# EAGLE design LED_KnuckleBuster (EAGLE 7.6.0)
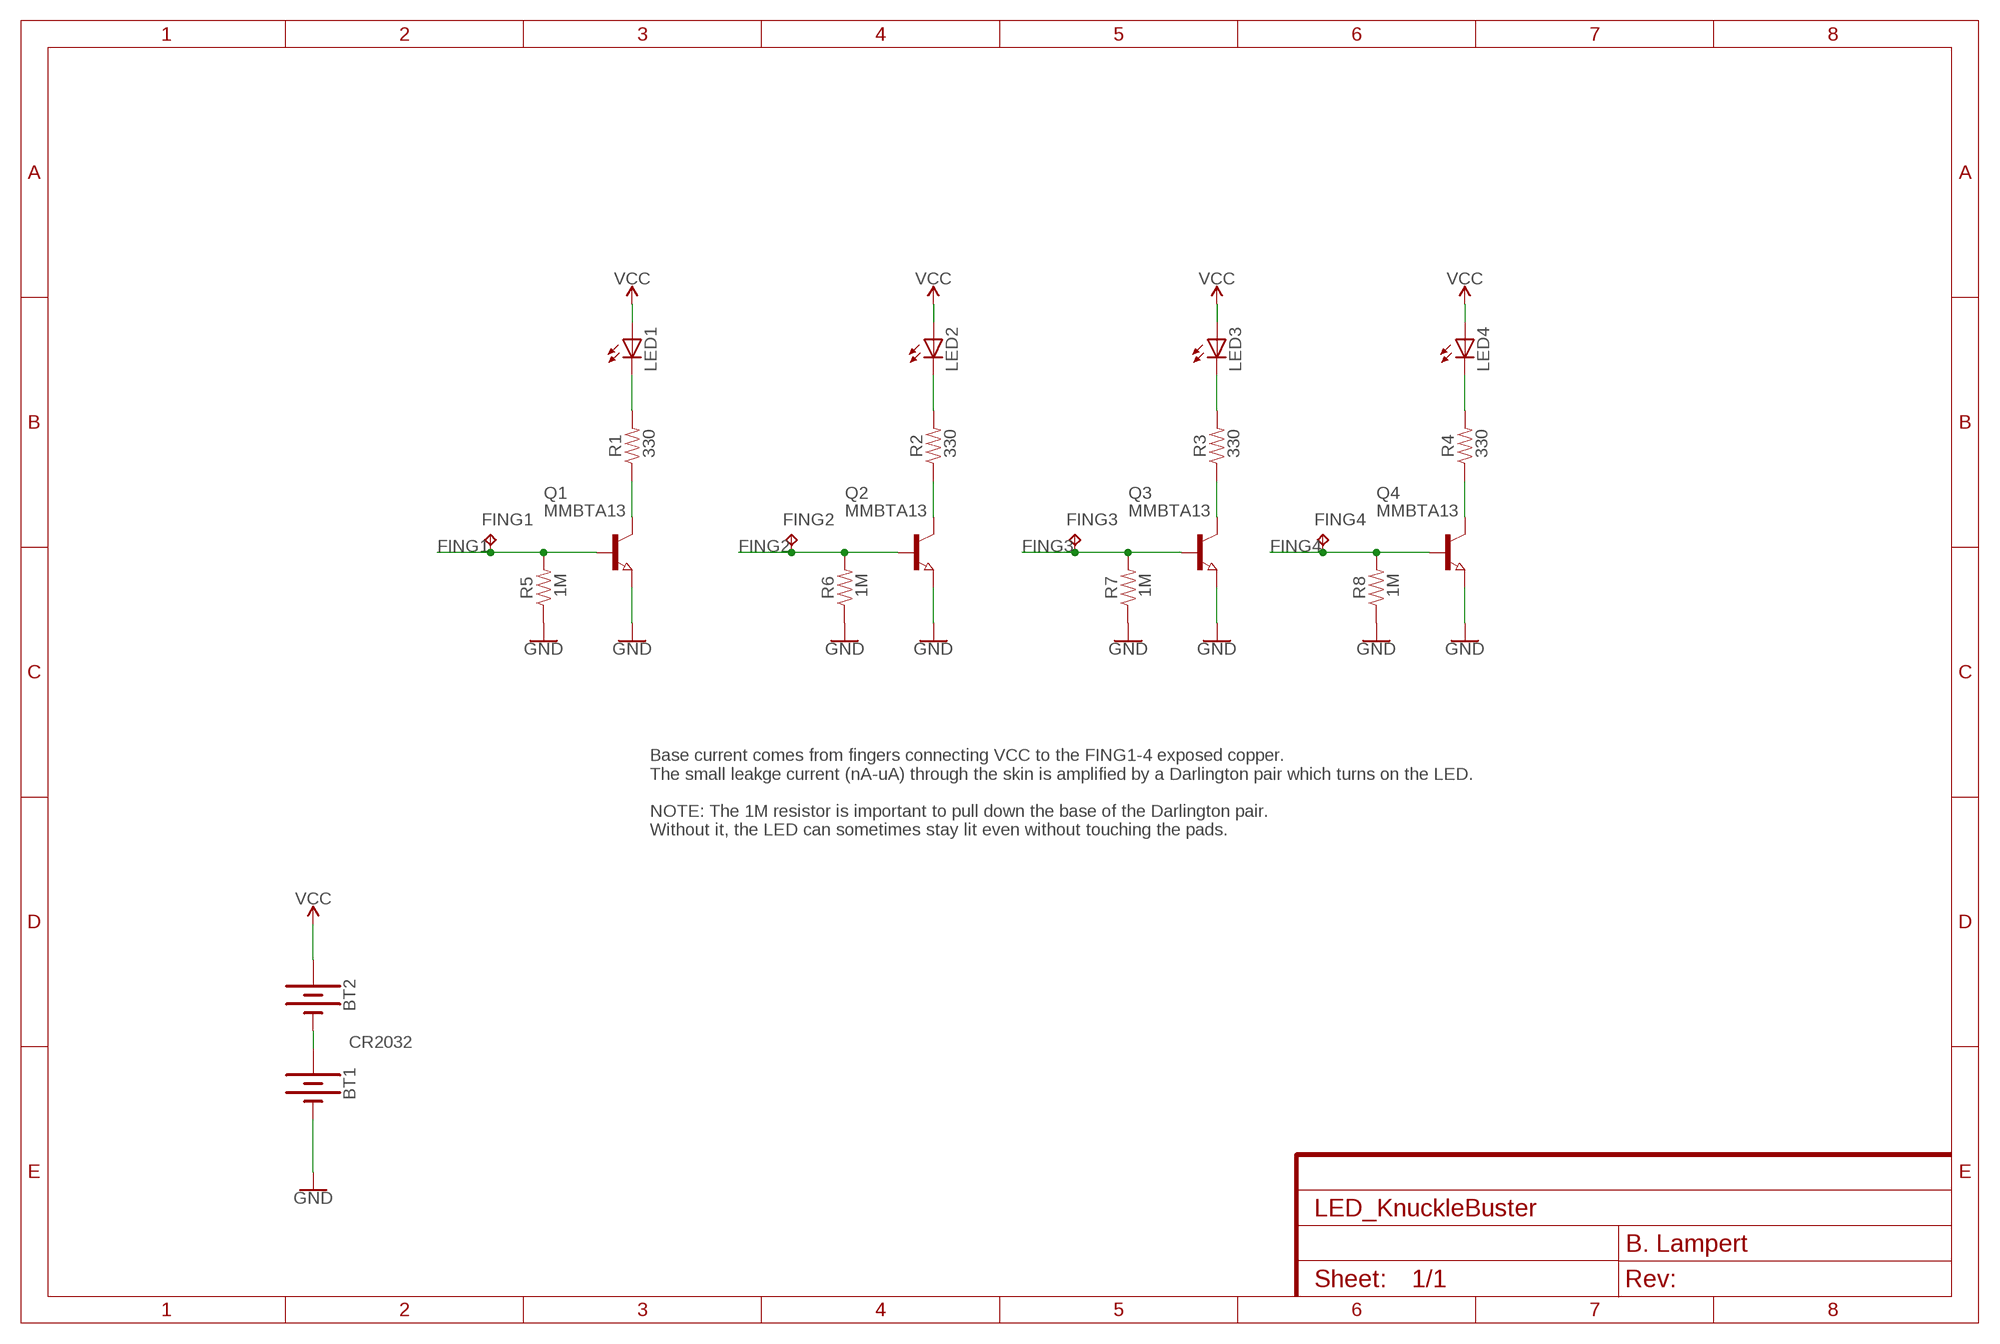
[diagram p0: schematic, sheet 1]

## Parts
BT1  BATTERY-20MM_SMD_4LEGS  [BATTCON_20MM_4LEGS]
BT2  BATTERY-20MM_SMD_4LEGS  [BATTCON_20MM_4LEGS]
FING1  TPB2,54  [B2,54]
FING2  TPB2,54  [B2,54]
FING3  TPB2,54  [B2,54]
FING4  TPB2,54  [B2,54]
LED1  LEDCHIPLED_0805  [CHIPLED_0805]
LED2  LEDCHIPLED_0805  [CHIPLED_0805]
LED3  LEDCHIPLED_0805  [CHIPLED_0805]
LED4  LEDCHIPLED_0805  [CHIPLED_0805]
Q1  MMBTA13  NPN-TRANSISTOR_SOT23  [SOT23]
Q2  MMBTA13  NPN-TRANSISTOR_SOT23  [SOT23]
Q3  MMBTA13  NPN-TRANSISTOR_SOT23  [SOT23]
Q4  MMBTA13  NPN-TRANSISTOR_SOT23  [SOT23]
R1  330  RESISTOR0603  [0603]
R2  330  RESISTOR0603  [0603]
R3  330  RESISTOR0603  [0603]
R4  330  RESISTOR0603  [0603]
R5  1M  RESISTOR0603  [0603]
R6  1M  RESISTOR0603  [0603]
R7  1M  RESISTOR0603  [0603]
R8  1M  RESISTOR0603  [0603]

## Nets
FING1: FING1.TP Q1.1(B) R5.2
FING2: FING2.TP Q2.1(B) R6.2
FING3: FING3.TP Q3.1(B) R7.2
FING4: FING4.TP Q4.1(B) R8.2
GND: BT1.NEGATIVE(-) Q1.2(E) Q2.2(E) Q3.2(E) Q4.2(E) R5.1 R6.1 R7.1 R8.1
N$1: Q1.3(C) R1.1
N$2: LED1.C R1.2
N$3: Q2.3(C) R2.1
N$4: LED2.C R2.2
N$5: Q3.3(C) R3.1
N$6: LED3.C R3.2
N$7: Q4.3(C) R4.1
N$8: LED4.C R4.2
N$9: BT1.POSITIVE@1(+) BT1.POSITIVE@2(+) BT1.POSITIVE@3(+) BT1.POSITIVE@4(+) BT2.NEGATIVE(-)
VCC: BT2.POSITIVE@1(+) BT2.POSITIVE@2(+) BT2.POSITIVE@3(+) BT2.POSITIVE@4(+) LED1.A LED2.A LED3.A LED4.A

## Notes on the sheet
- Base current comes from fingers connecting VCC to the FING1-4 exposed copper.
  The small leakge current (nA-uA) through the skin is amplified by a Darlington pair which turns on the LED.
  
  NOTE: The 1M resistor is important to pull down the base of the Darlington pair.
  Without it, the LED can sometimes stay lit even without touching the pads.
- CR2032

## Library data of the parts
BT1 BT2 = SparkFun-Batteries:BATTERY: Battery - Single Cell A variety of battery chemistries, sizes, and footprints. Device List: 20MM_PTH - Coin Cell Battery Holder - 20mm (PTH) <https://www.sparkfun.com/products/783> 6.8MM_PTH - Coin Cell Battery Holder - 6.8MM(SMD) <https://www.digikey.com/product-detail/en/seiko-instruments/MS621FE-FL11E/728-1057-ND/1889208?WT.srch=1&gclid=CNOQ5a6LzdQCFZS2wAodXCkE0g> 12MM_SMD - Coin Cell Battery Holder - 12mm (SMD) <https://www.sparkfun.com/products/10592> 12MM_PTH - Coin Cell Battery Holder - 12mm (PTH) <https://www.sparkfun.com/products/7948> 20MM_SMD - 20mm Coin Cell Battery Holder (SMD) (2 legs) Used on the Big Time Watch Kit <https://www.sparkfun.com/products/11734> 20MM_SMD_4LEGS - Coin Cell Battery Holder - 20mm (SMD) <https://www.sparkfun.com/products/11892> 20MM_SMD_4LEGS_OVERPASTE - Coin Cell Battery Holder - 20mm (SMD) <https://www.sparkfun.com/products/11892> (Over-paste on the legs) 24.5MM_PTH - Coin Cell Battery Holder - 24.5mm (PTH) <https://www.sparkfun.com/products/8863> 9V - 9V Battery Holder - PC Mount Used on the SparkFun SparkPunk Sound Kit <https://www.sparkfun.com/products/11177> and SparkFun SparkPunk Sequencer Kit <https://www.sparkfun.com/products/12707> 18650 - Battery Holder - 18650 (PTH) <https://www.sparkfun.com/products/13113> AA - Battery Holder - 1xAA (PTH) <https://www.sparkfun.com/products/7949> AAA - Battery Holder - 1xAAA (PTH) <https://www.sparkfun.com/products/12718> AA_KIT - Battery Holder - 1xAA (PTH) <https://www.sparkfun.com/products/7949> Special kit package - pads only have exposed copper on one side of the board. AAA_KIT - Battery Holder - 1xAAA (PTH) <https://www.sparkfun.com/products/12718> Special kit package - pads only have exposed copper on one side of the board.; PROD_ID: BATT-10373; SF_SKU: PRT-11892
FING1-FING4 = testpad:TP: Test pad
LED1-LED4 = led:LED: LED OSRAM: - CHIPLED LG R971, LG N971, LY N971, LG Q971, LY Q971, LO R971, LY R971 LH N974, LH R974 LS Q976, LO Q976, LY Q976 LO Q996 - Hyper CHIPLED LW Q18S LB Q993, LB Q99A, LB R99A - SideLED LS A670, LO A670, LY A670, LG A670, LP A670 LB A673, LV A673, LT A673, LW A673 LH A674 LY A675 LS A676, LA A676, LO A676, LY A676, LW A676 LS A679, LY A679, LG A679 - Hyper Micro SIDELED® LS Y876, LA Y876, LO Y876, LY Y876 LT Y87S - SmartLED LW L88C, LW L88S LB L89C, LB L89S, LG L890 LS L89K, LO L89K, LY L89K LS L896, LA L896, LO L896, LY L896 - TOPLED LS T670, LO T670, LY T670, LG T670, LP T670 LSG T670, LSP T670, LSY T670, LOP T670, LYG T670 LG T671, LOG T671, LSG T671 LB T673, LV T673, LT T673, LW T673 LH T674 LS T676, LA T676, LO T676, LY T676, LB T676, LH T676, LSB T676, LW T676 LB T67C, LV T67C, LT T67C, LS T67K, LO T67K, LY T67K, LW E67C LS E67B, LA E67B, LO E67B, LY E67B, LB E67C, LV E67C, LT E67C LW T67C LS T679, LY T679, LG T679 LS T770, LO T770, LY T770, LG T770, LP T770 LB T773, LV T773, LT T773, LW T773 LH T774 LS E675, LA E675, LY E675, LS T675 LS T776, LA T776, LO T776, LY T776, LB T776 LHGB T686 LT T68C, LB T68C - Hyper Mini TOPLED® LB M676 - Mini TOPLED Santana® LG M470 LS M47K, LO M47K, LY M47K Source: http://www.osram.convergy.de LUXEON: - LUMILED® LXK2-PW12-R00, LXK2-PW12-S00, LXK2-PW14-U00, LXK2-PW14-V00 LXK2-PM12-R00, LXK2-PM12-S00, LXK2-PM14-U00 LXK2-PE12-Q00, LXK2-PE12-R00, LXK2-PE12-S00, LXK2-PE14-T00, LXK2-PE14-U00 LXK2-PB12-K00, LXK2-PB12-L00, LXK2-PB12-M00, LXK2-PB14-N00, LXK2-PB14-P00, LXK2-PB14-Q00 LXK2-PR12-L00, LXK2-PR12-M00, LXK2-PR14-Q00, LXK2-PR14-R00 LXK2-PD12-Q00, LXK2-PD12-R00, LXK2-PD12-S00 LXK2-PH12-R00, LXK2-PH12-S00 LXK2-PL12-P00, LXK2-PL12-Q00, LXK2-PL12-R00 Source: www.luxeon.com KINGBRIGHT: KA-3528ASYC Source: www.kingbright.com
Q1-Q4 = semicon-smd-ipc:NPN-TRANSISTOR_: NPN TRANSISTOR
R1-R8 = SparkFun-Resistors:RESISTOR: Generic Resistor Package

## Board
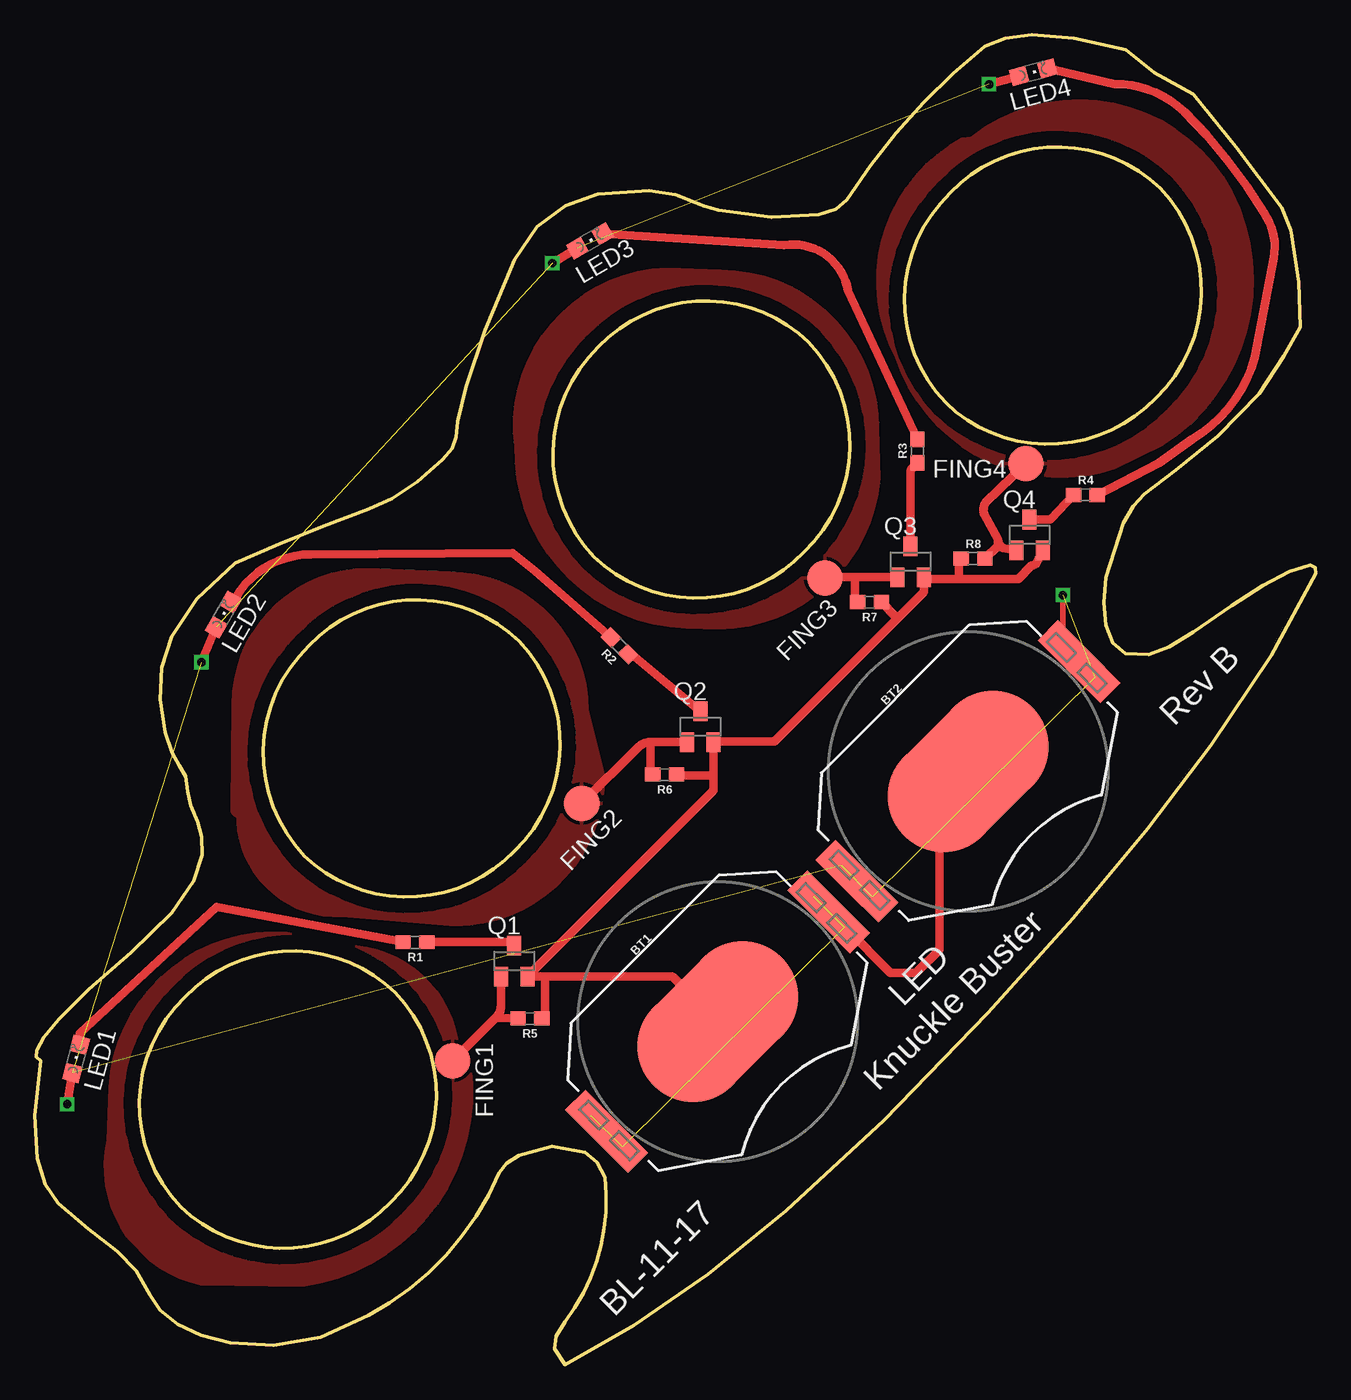
[diagram p1: board, top side]
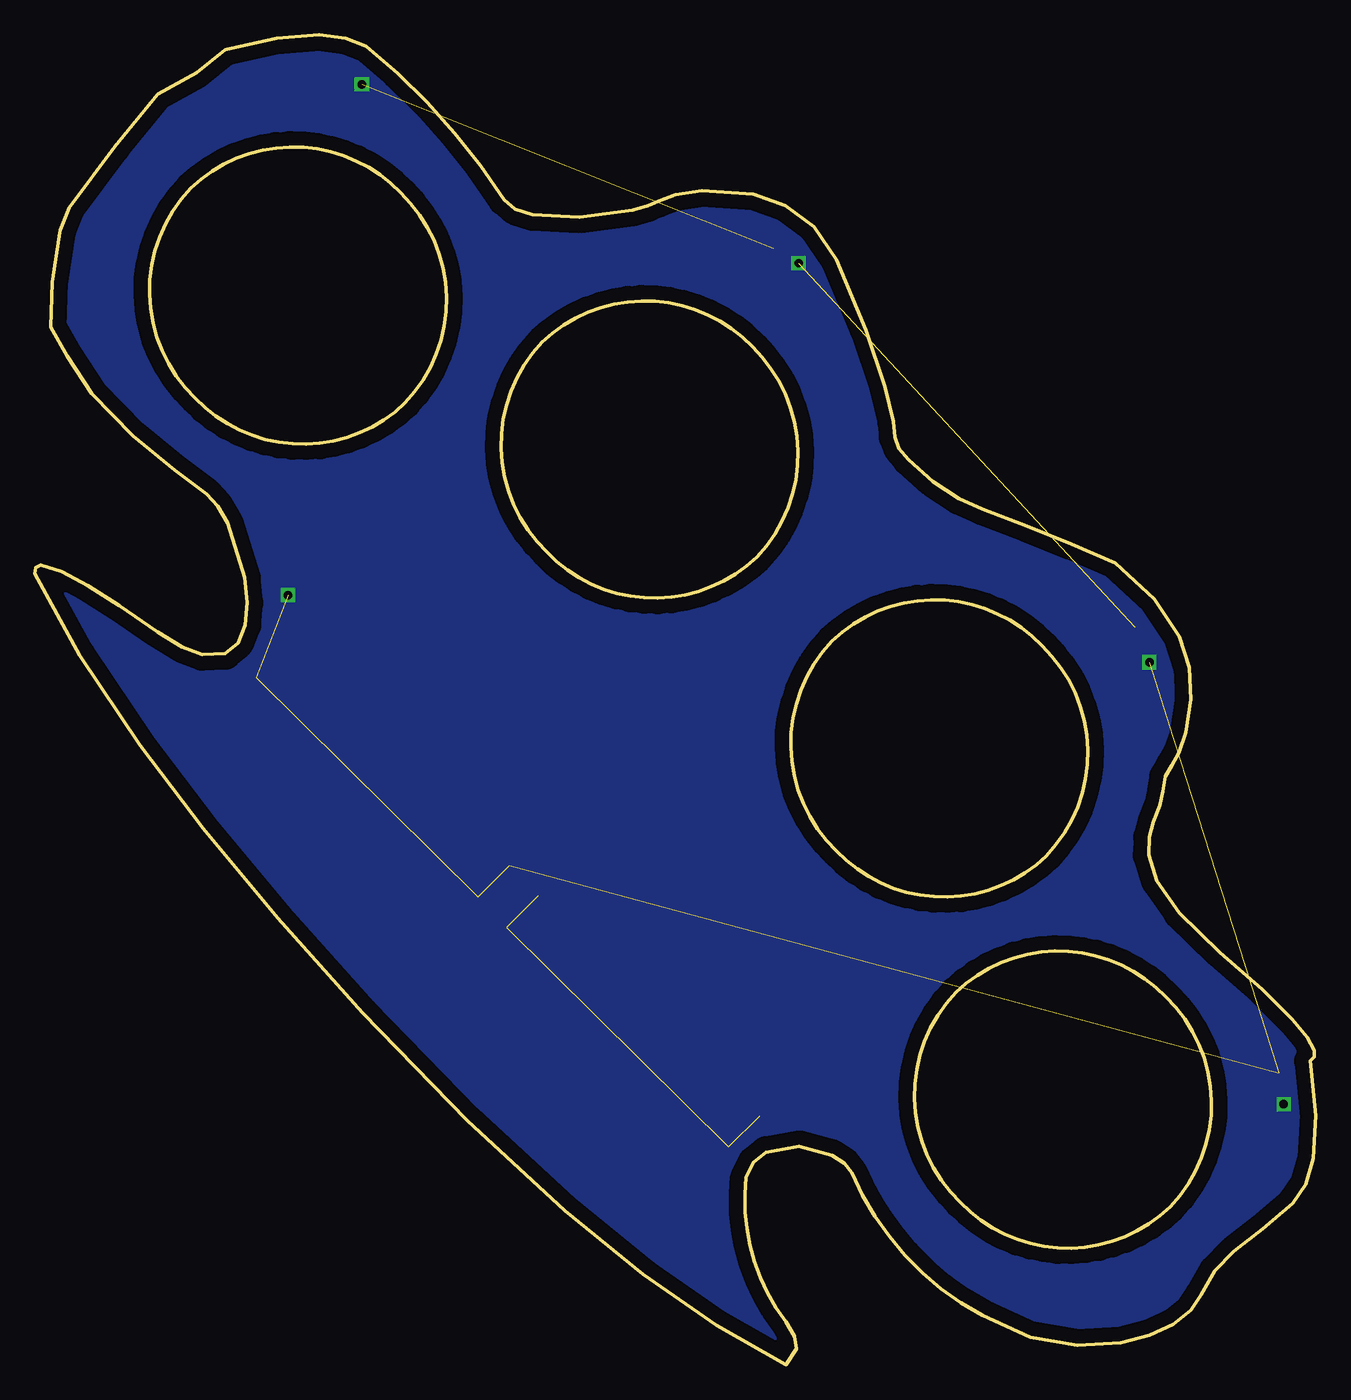
[diagram p2: board, bottom side, seen from below]

Size 91.69 x 95.17 mm. Coordinates in mm from the lower left corner, seen from the top.
Outline: 89.88,81.23 90.46,77.46 90.57,74.27 89.39,72.18 87.64,69.51 84.67,66.44 81.67,64.02 79.4,62.31 78.62,61.45 77.9,60.24 76.67,56.32 76.5,54.53 76.64,52.92 77.15,51.65 78.06,50.88 79.73,50.82 81.17,51.36 82.91,52.44 85.66,54.34 87.9,55.75 89.79,56.78 91.27,57.21 91.63,57.05 91.69,56.61 88.48,50.76 84.17,44.3 79.65,38.36 74.33,31.98 68.22,25.17 60.77,17.49 53.76,11.02 48.17,6.47 42.89,2.8 37.94,0 37.18,1.13 37.32,2.03 37.94,3.07 arc44 40.79,13.38 40.25,14.49 39.36,15.19 37,15.6 34.65,14.99 33.76,14.41 33.22,13.71 arc-38 23.89,3.51 20.45,1.96 17.07,1.37 13.96,1.55 11.92,2.09 10.23,2.89 8.97,3.88 8.25,4.98 7.25,6.71 5.88,8.1 3.82,9.71 1.66,11.56 0.74,12.92 0.18,14.77 0,17.84 0.42,21.72 0.11,22.01 0.12,22.5 0.63,23.44 1.69,24.72 3.84,26.84 6.89,29.51 9.79,32.32 11.38,34.61 11.97,36.47 11.94,37.75 11.64,38.84 11.16,40.01 10.95,41.03 10.8,42.09 10.33,42.88 9.82,43.77 9.33,45.24 8.97,47.61 9.08,49.89 9.8,52.1 11.58,54.8 14.35,57.37 arc-5 23.89,61.21 25.56,61.98 27.4,63.21 29.18,64.77 29.84,65.57 30.15,66.37 30.25,67.49 30.85,69.99 32.22,74.04 34.34,79.07 35.94,81.44 37.99,82.96 40.25,83.79 43.95,84.03 45.84,83.72 47.04,83.26
Outline: 89.23,82.8 85.96,87.17 82.9,90.92 80.11,92.47 78.09,94.13 74.38,94.94 71.35,95.17 69.46,94.94 67.99,94.35 arc19 58.12,83.37 57.33,82.7 56.07,82.29 52.7,82.13 48.93,82.63 47.8,82.94 47.04,83.26
Outline: 47.04,83.26 47.04,83.26
Outline: 19.29,36.42 arc90 34.32,36.75 arc90 34.64,51.78 arc90 19.62,51.45 arc90 19.29,36.42
Outline: 65.52,83.86 arc-90 80.55,84.19 arc-90 80.22,69.16 arc-90 65.19,68.83 arc-90 65.52,83.86
Outline: 89.87,81.19 89.23,82.82
Outline: 25.78,26.64 arc90 10.75,26.31 arc90 10.43,11.28 arc90 25.46,11.61 arc90 25.78,26.64
Outline: 55.38,73.17 arc90 40.35,72.84 arc90 40.02,57.81 arc90 55.05,58.14 arc90 55.38,73.17
Copper layers (1*16): Top 0.035mm / dielectric 1.5mm / Bottom 0.035mm
Design rules "default": minimum track width 10mil, minimum drill 24mil, track to track 8mil, track to pad 8mil, pad to pad 8mil, via to via 8mil, smd to smd 8mil, copper to edge 40mil, drill to drill 8mil, minimum pad ring 10mil, minimum via ring 8mil, stop-mask expansion 4mil, vias tented up to drill 0mil, thermal gap 10mil

### Footprints (pad centres in the part's own frame; a part is rotated, then mirrored left to right if it is on the bottom)
BATTCON_20MM_4LEGS = smd 13 x 8: NEGATIVE 0,0 | smd 2.032 x 3.175: POSITIVE@1 -11.176,1.651; POSITIVE@2 -11.176,-1.524; POSITIVE@3 11.176,1.524; POSITIVE@4 11.176,-1.651
B2,54 = smd 2.54 x 2.54: TP 0,0
CHIPLED_0805 = smd 1.2 x 1.2: A 0,-1.05; C 0,1.05
SOT23 = smd 1 x 1.4: 1 -0.95,-1.1; 2 0.95,-1.1; 3 0,1.1
0603 = smd 1.1 x 1: 1 -0.85,0; 2 0.85,0

### Placement (x,y rotation side)
BT1  48.87,24.55 45 top
BT2  66.79,42.45 45 top
FING1  29.89,21.73 270 top
FING2  39.14,40.16 225 top
FING3  56.55,56.29 225 top
FING4  70.94,64.49 180 top
LED1  2.95,21.88 345 top
LED2  13.5,53.68 330 top
LED3  39.73,80.43 300 top
LED4  71.44,92.5 285 top
Q1  34.31,28.88 0 top
Q2  47.63,45.65 0 top
Q3  62.68,57.46 0 top
Q4  71.19,59.38 0 top
R1  27.2,30.23 180 top
R2  41.84,51.44 135 top
R3  63.17,65.38 90 top
R4  75.19,62.25 0 top
R5  35.43,24.77 180 top
R6  45.07,42.23 180 top
R7  59.74,54.57 180 top
R8  67.15,57.68 0 top

### Tracks (layer width: path | path; a pad name or v marks a point on that pad's centre or on a via)
FING1
  Top 0.61: FING1.TP 32.99,24.83 | 32.99,24.83 arc45 33.36,25.72 Q1.1 | R5.2 32.99,24.83
  pour Top: 5.23,16.01 arc90 11.87,5.78 19.13,5.69 arc90 31.15,21.36 30.3,21.79 arc90 22.26,29.94 18.02,30.88 arc90 5.37,19.85
FING2
  Top 0.61: FING2.TP 43.16,44.18 arc-45 44.06,44.55 | 44.06,44.55 Q2.1 | R6.2 44.06,42.39 44.06,44.55
  pour Top: 14.53,38.92 arc90 21.99,32.14 30.13,31.48 arc90 40.69,42.13 39.52,46.83 arc90 29.71,56.64 23.83,56.9 arc90 14.2,47.26 14.11,39.77 arc90 14.53,39.26
FING3
  Top 0.61: FING3.TP arc-45 56.71,56.36 58.68,56.36 | 58.68,56.36 Q3.1 | R7.2 58.68,54.78 58.68,56.36
  pour Top: 49.05,78.25 45.24,78.42 arc90 34.32,66.71 34.44,65.74 arc90 46.62,52.79 47.86,52.76 arc90 60.4,63.42 60.3,67.01 arc90
FING4
  Top 0.61: FING4.TP 68.04,61.71 arc45 67.94,60.83 68.91,59.08 | 68.91,59.08 68.92,59.1 arc45 69.27,58.44 Q4.1 | R8.2 68.91,58.59 68.91,59.08
  pour Top: 67.02,87.78 66.39,87.72 arc90 61.69,72.09 arc90 77.27,64.19 80.69,65.88 arc90 84.99,85 arc94
GND
  Top 0.61: Q4.2 71.7,57.38 arc-45 71.34,57.18 70.39,56.23 66.15,56.23 | 66.15,56.23 63.86,56.23 arc-45 63.68,56.31 Q3.2 63.63,55.39 arc-45 63.55,55.21 61.64,53.3 | 61.64,53.3 52.95,44.6 48.72,44.6 arc45 Q2.2 48.58,42.16 | 48.58,42.16 48.58,41.21 arc-45 48.51,41.03 Q1.2 36.5,27.78 | 36.5,27.78 45.53,27.78 arc-45 45.71,27.7 BT1.NEGATIVE | R5.1 36.5,24.99 36.5,27.78 | R6.1 45.99,42.16 48.58,42.16 | R7.1 61.64,53.51 61.64,53.3 | R8.1 66.15,57.53 66.15,56.23
N$1
  Top 0.61: R1.1 34.05,30.23 arc-90 Q1.3
N$2
  Top 0.61: R1.2 13.01,32.77 3.22,23.72 LED1.C
N$3
  Top 0.61: Q2.3 42.97,50.65 R2.1
N$4
  Top 0.61: R2.2 35.8,56.81 34.18,58.09 19.74,57.99 arc59 14.4,54.95 arc-32 LED2.C
N$5
  Top 0.61: Q3.3 62.68,63.93 arc-45 62.75,64.11 R3.1
N$6
  Top 0.61: R3.2 58.2,76.85 arc90 53.63,80.11 LED3.C
N$7
  Top 0.61: R4.1 72.75,60.55 arc-45 72.57,60.48 Q4.3
N$8
  Top 0.61: R4.2 80.45,64.52 82.83,66.24 arc45 87.3,72.1 88.67,79.23 arc45 87.98,82.39 arc14 82.26,89.66 arc45 77.29,91.65 LED4.C
N$9  (3 unrouted)
  Top 0.61: BT2.NEGATIVE 64.81,40.47 arc45 64.73,40.29 64.73,29.69 63.17,28.12 arc-45 62.99,28.05 61.24,28.05 58.05,31.24 arc45 BT1.POSITIVE@4
VCC  (via drill 0.6)  (7 unrouted)
  Top 0.406: BT2.POSITIVE@3 73.58,51.43 v73.58,55.07
  Top 0.61: LED1.A v2.31,18.63 | LED2.A v11.92,50.27 | LED3.A v37.03,78.83 | LED4.A v68.29,91.63
  pour Bottom: -20.09,105.87 100.27,105.87 arc-90 110.27,95.87 110.27,-4.98 -10.09,-4.98 arc-90 -20.09,5.02

### Text on the board
tNames: Rev B | LED | Knuckle Buster | BL-11-17
bStop: www.benlampert.org